# Altium schematic sheet [9]_ID_Serial.SchDoc
size A3; DocumentNumber: 9; SheetNumber: 9; SheetTotal: 9; PageSetup: Record=PageOptions|CenterHorizontal=True|CenterVertical=True|PrintScale=0.97|XCorrection=1.00|YCorrection=1.00|PrintKind=1|BorderSize=5000000|LeftOffset=0|BottomOffset=0|Orientation=2|PaperLength=2970|PaperWidth=2100|Scale=100|PaperSource=7|PrintQuality=600|MediaType=1|DitherType=10|PaperKind=A4|PrintScaleMode=1
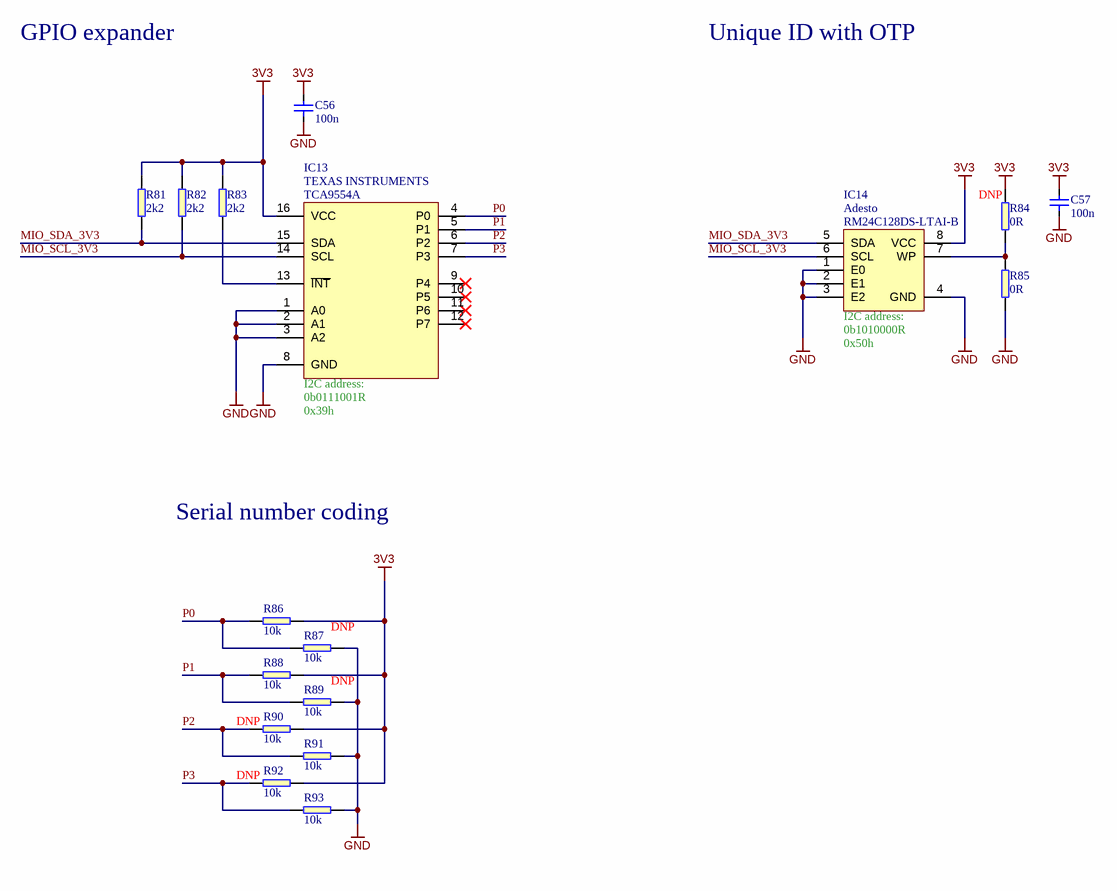
[diagram p0: [9]_ID_Serial.SchDoc]

## Parts
C56  100n  [0402]
C57  100n  [0402]
IC13  Manufacturer: TEXAS INSTRUMENTS  [DBQ0016A]  (hidden comment: TCA9554A)
IC14  Manufacturer: Adesto  [TSSOP-8]  (hidden comment: RM24C128DS-LTAI-B)
R81  2k2  [0402]
R82  2k2  [0402]
R83  2k2  [0402]
R84  0R  [0402]
R85  0R  [0402]
R86  10k  [0402]
R87  10k  [0402]
R88  10k  [0402]
R89  10k  [0402]
R90  10k  [0402]
R91  10k  [0402]
R92  10k  [0402]
R93  10k  [0402]

## Nets
3V3: C56.2 C57.2 IC13.16(VCC) IC14.8(VCC) R81.2 R82.2 R83.2 R84.2 R86.2 R88.2 R90.2 R92.2
GND: C56.1 C57.1 IC13.1(A0) IC13.2(A1) IC13.3(A2) IC13.8(GND) IC14.1(E0) IC14.2(E1) IC14.3(E2) IC14.4(GND) R85.1 R87.2 R89.2 R91.2 R93.2
MIO_SCL_3V3: IC13.14(SCL) IC14.6(SCL) R82.1
MIO_SDA_3V3: IC13.15(SDA) IC14.5(SDA) R81.1
P0: IC13.4(P0) R86.1 R87.1
P1: IC13.5(P1) R88.1 R89.1
P2: IC13.6(P2) R90.1 R91.1
P3: IC13.7(P3) R92.1 R93.1
NetIC13_13: IC13.13(~{INT}) R83.1
NetIC14_7: IC14.7(WP) R84.1 R85.2

Not connected (* = marked no-connect by the designer): IC13 9(P4)* 10(P5)* 11(P6)* 12(P7)*

## Notes on the sheet
- GPIO expander
- Unique ID with OTP
- (near R84) DNP
- (near IC14) 0b1010000R
- (near IC14) 0x50h
- (near IC14) I2C address:
- (near IC13) 0b0111001R
- (near IC13) 0x39h
- (near IC13) I2C address:
- Serial number coding
- (near R87) DNP
- (near R89) DNP
- (near R90) DNP
- (near R92) DNP
- Title:
- Size:
- Date:
- A3
- Revision:
- Page:
- of
- Antmicro Ltd.
- File:
- www.antmicro.com

## Library data of the parts
C56 C57 = C_100n_0402: MLCC SMT Capacitor 100nF 0402; Manufacturer: MULTICOMP; Part Symbol: MC0402X104M100CT; Voltage: 10V; Tolerance: +-20%; Part Number: C_100n_0402; Value: 100n
IC13 = TCA9554A: Remote 8bit I2C SMBus I/O expander; Part Number: TCA9554A; Value: TCA9554A; Part Symbol: TCA9554A
IC14 = RM24C128DS: EEPROM with UID and OTP registers.; Part Number: RM24C128DS; Value: RM24C128DS-LTAI-B; Part Symbol: RM24C128DS-LTAI-B
R81-R83 = R_2k2_0402: SMT Resistor 2k2 0402; Manufacturer: MULTICOMP; Part Symbol: MCWR04X2201FTL; Tolerance: 5%; Part Number: R_2k2_0402; Value: 2k2
R84 R85 = R_0R_0402: SMT Resistor 0R 0402; Manufacturer: MULTICOMP; Part Symbol: MCMR04X000 PTL; Part Number: R_0R_0402; Value: 0R
R86-R93 = R_10k_0402: SMT Resistor 10k 0402; Manufacturer: MULTICOMP; Part Symbol: MCMR04X1002FTL; Tolerance: 1%; Part Number: R_10k_0402; Value: 10k